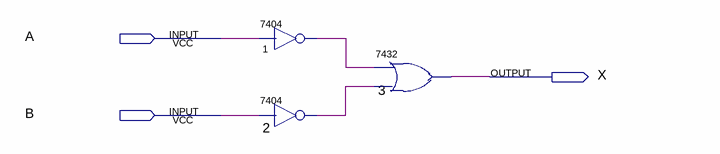
[diagram p0: schematic sheet]
// Quartus schematic Project.bdf as structural Verilog: 3 symbols, 3 pins
module Project (
  input  A,
  input  B,
  output X
);

  wire n1_1, n2_1;

  \7404  u_1 (.\2 (A), .\1 (n1_1));
  \7404  u_2 (.\2 (B), .\1 (n2_1));
  \7432  u_3 (.\2 (n1_1), .\3 (n2_1), .\1 (X));
endmodule
